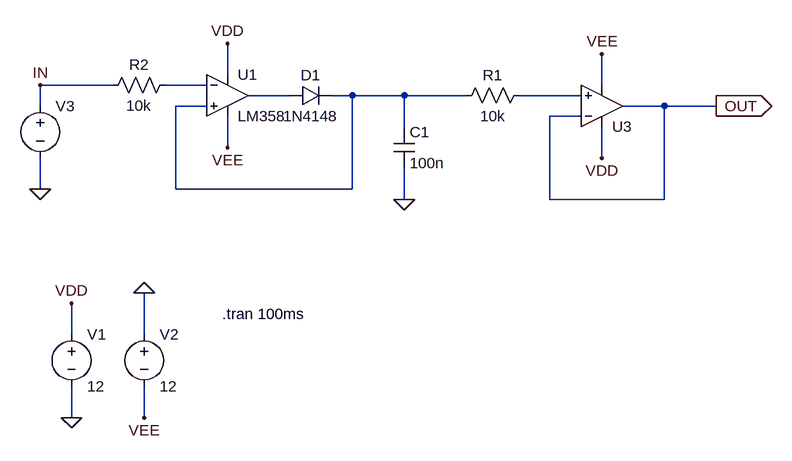
[diagram p0: schematic v1.0.asc]
v1.0.asc, the LTspice schematic file:
Version 4.1
SHEET 1 1532 680
WIRE 464 -128 464 -176
WIRE 288 -112 176 -112
WIRE 432 -112 368 -112
WIRE 1040 -112 1040 -160
WIRE 560 -96 496 -96
WIRE 656 -96 624 -96
WIRE 736 -96 656 -96
WIRE 832 -96 736 -96
WIRE 1008 -96 912 -96
WIRE 176 -80 176 -112
WIRE 432 -80 384 -80
WIRE 1136 -80 1072 -80
WIRE 1216 -80 1136 -80
WIRE 1008 -64 960 -64
WIRE 736 -48 736 -96
WIRE 464 -16 464 -64
WIRE 1040 0 1040 -48
WIRE 176 48 176 0
WIRE 384 48 384 -80
WIRE 656 48 656 -96
WIRE 656 48 384 48
WIRE 736 64 736 16
WIRE 960 64 960 -64
WIRE 1136 64 1136 -80
WIRE 1136 64 960 64
WIRE 224 272 224 224
WIRE 336 272 336 208
WIRE 224 400 224 352
WIRE 336 400 336 352
FLAG 224 224 VDD
FLAG 336 400 VEE
FLAG 336 208 0
FLAG 224 400 0
FLAG 464 -16 VEE
FLAG 464 -176 VDD
FLAG 736 64 0
FLAG 1216 -80 OUT
IOPIN 1216 -80 Out
FLAG 176 48 0
FLAG 176 -112 IN
FLAG 1040 -160 VEE
FLAG 1040 0 VDD
SYMBOL MyLib\\OpAmp\\LM358 464 -160 R0
WINDOW 38 16 96 Invisible 2
SYMATTR InstName U1
SYMBOL voltage 224 256 R0
WINDOW 123 0 0 Left 0
WINDOW 39 0 0 Left 0
SYMATTR InstName V1
SYMATTR Value 12
SYMBOL voltage 336 256 R0
WINDOW 123 0 0 Left 0
WINDOW 39 0 0 Left 0
SYMATTR InstName V2
SYMATTR Value 12
SYMBOL diode 560 -80 R270
WINDOW 0 32 32 VTop 2
WINDOW 3 0 32 VBottom 2
SYMATTR InstName D1
SYMATTR Value 1N4148
SYMBOL cap 720 -48 R0
SYMATTR InstName C1
SYMATTR Value 100n
SYMBOL voltage 176 -96 R0
WINDOW 3 41 64 Invisible 2
WINDOW 123 0 0 Left 0
WINDOW 39 0 0 Left 0
SYMATTR Value SINE(0 1.2 50)
SYMATTR InstName V3
SYMBOL res 928 -112 R90
WINDOW 0 0 56 VBottom 2
WINDOW 3 32 56 VTop 2
SYMATTR InstName R1
SYMATTR Value 10k
SYMBOL OpAmps\\UniversalOpAmp 1040 -80 M180
SYMATTR InstName U3
SYMBOL res 384 -128 R90
WINDOW 0 0 56 VBottom 2
WINDOW 3 32 56 VTop 2
SYMATTR InstName R2
SYMATTR Value 10k
TEXT 456 240 Left 2 !.tran 100ms

The netlist it stands for:
* v1.0.asc
* U1: LM358 (symbol MyLib\OpAmp\LM358 not available, pins judged from their places): In+=N003 In-=N001 V+=VDD V-=VEE OUT=N002
V1 VDD 0 12
V2 0 VEE 12
D1 N002 N003 1N4148
C1 N003 0 100n
V3 IN 0 SINE(0 1.2 50)
R1 N004 N003 10k
X§U3 N004 OUT VDD VEE OUT level1 Avol=1Meg GBW=10Meg Vos=0 En=0 Enk=0 In=0 Ink=0 Rin=500Meg  ; pins In+ In- V+ V- OUT
R2 N001 IN 10k
.model D D
.lib standard.dio
.tran 100ms
.lib UniversalOpAmp1.lib
.backanno
.end